# EAGLE design RGBWW-003 (EAGLE 7.7.0)
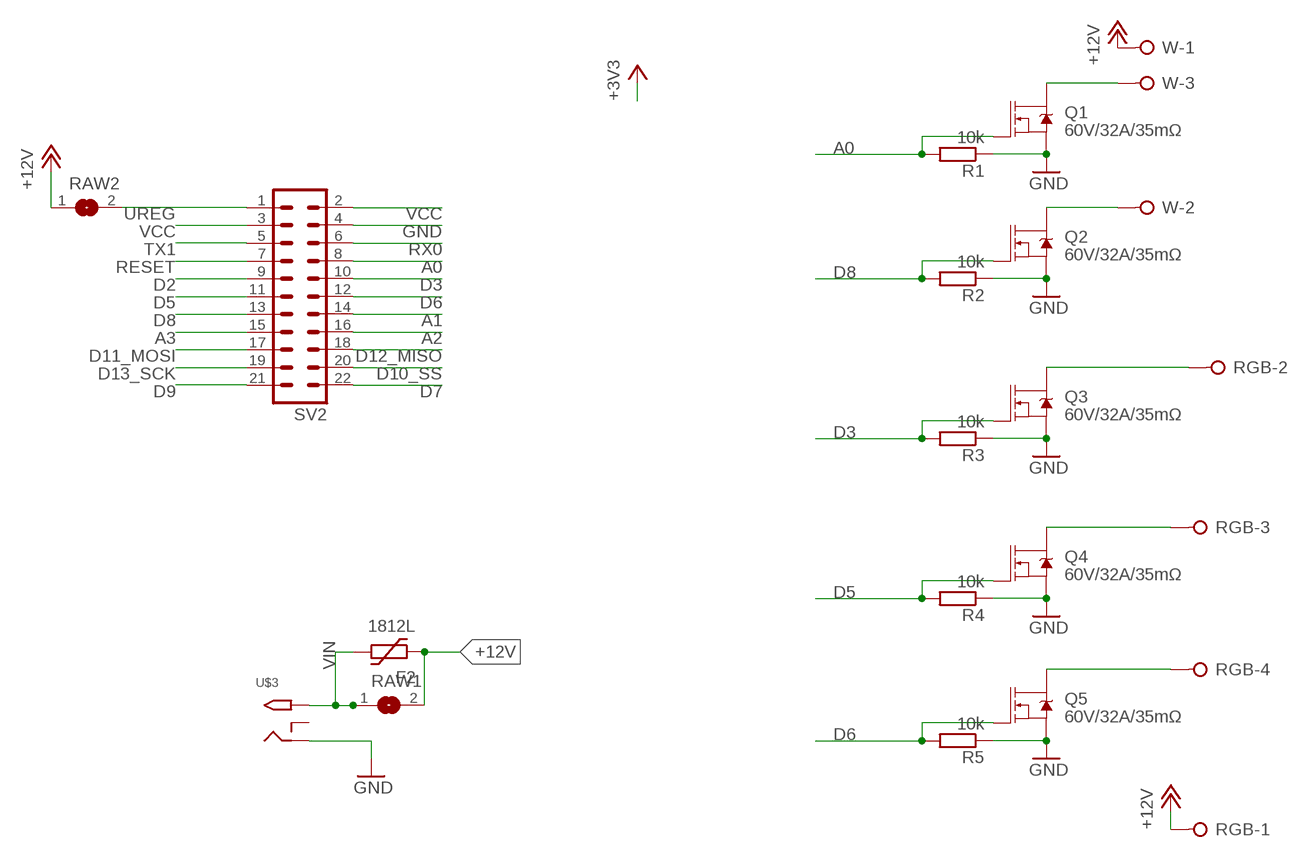
[diagram p0: schematic, sheet 1]

## Parts
F2  1812L  [1812L]
Q1  60V/32A/35mΩ  MOSFET-NCH-FQP30N06L  [TO220V]
Q2  60V/32A/35mΩ  MOSFET-NCH-FQP30N06L  [TO220V]
Q3  60V/32A/35mΩ  MOSFET-NCH-FQP30N06L  [TO220V]
Q4  60V/32A/35mΩ  MOSFET-NCH-FQP30N06L  [TO220V]
Q5  60V/32A/35mΩ  MOSFET-NCH-FQP30N06L  [TO220V]
R1  10k  R-EU_R0805  [R0805]
R2  10k  R-EU_R0805  [R0805]
R3  10k  R-EU_R0805  [R0805]
R4  10k  R-EU_R0805  [R0805]
R5  10k  R-EU_R0805  [R0805]
RAW1  SJ  [SJ]
RAW2  SJ  [SJ]
RGB  W237-04P  [W237-4P]
SV2  MA11-2  [MA11-2]
U$3  2.1MMJACKTHM  [PJ-102A]
W  W237-03P  [W237-133]

## Nets
+12V [12V]: F2.P$1 RAW1.2 RAW2.1 RGB.1 W.1
A0: Q1.1(G) R1.2 SV2.8
A1: SV2.14
A2: SV2.16
A3: SV2.15
D2: SV2.9
D3: Q3.1(G) R3.2 SV2.10
D5: Q4.1(G) R4.2 SV2.11
D6: Q5.1(G) R5.2 SV2.12
D7: SV2.22
D8: Q2.1(G) R2.2 SV2.13
D9: SV2.21
D10_SS: SV2.20
D11_MOSI: SV2.17
D12_MISO: SV2.18
D13_SCK: SV2.19
GND [GNDRGB]: Q1.3(S) Q2.3(S) Q3.3(S) Q4.3(S) Q5.3(S) R1.1 R2.1 R3.1 R4.1 R5.1 SV2.4 U$3.RING
RESET: SV2.7
RGB-WW-OUT [12V]: Q1.2(D) W.3
RGB-WW-OUT1 [12V]: Q2.2(D) W.2
RGB-WW-OUT2 [12V]: Q3.2(D) RGB.2
RGB-WW-OUT3 [GNDRGB]: Q4.2(D) RGB.3
RGB-WW-OUT4: Q5.2(D) RGB.4
RX0: SV2.6
TX1: SV2.5
UREG [12V]: RAW2.2 SV2.1
VCC [12V]: SV2.2 SV2.3
VIN [12V]: F2.P$2 RAW1.1 U$3.TIP
Unconnected: U$3.RING_SW

## Library data of the parts
F2 = ptc-littlefuse:1812L
Q1-Q5 = SparkFun-DiscreteSemi:MOSFET-NCH: N-channel MOSFETs Voltage controlled devices that allow control of high current outputs. SparkFun Products: SparkFun OpenScale <https://www.sparkfun.com/products/13261> SparkFun Digital Sandbox <https://www.sparkfun.com/products/12651> SparkFun Monster Moto Shield <https://www.sparkfun.com/products/10182> SparkFun MOSFET Power Controller <https://www.sparkfun.com/products/11214>; PROD_ID: TRANS-10060
R1-R5 = rcl:R-EU_: RESISTOR, European symbol
RAW1 RAW2 = jumper:SJ: SMD solder JUMPER
RGB = con-wago-508:W237-04P: WAGO SREW CLAMP; OC_FARNELL: unknown; OC_NEWARK: unknown
SV2 = con-Pinheader:MA11-2: PIN HEADER; OC_FARNELL: unknown; OC_NEWARK: unknown
U$3 = adafruit:2.1MMJACK: 2.1mm x 5.5mm THM DC jack with internal switch. Digikey part #PJ-102A, 4UCON part #05537 2.1mm x 5.5mm SMT DC jack with internal switch. Digikey part #PJ-002A-SMT, 4UCON part #03267 By microbuilder.eu & adafruit.com
W = con-wago-508:W237-03P: WAGO SREW CLAMP; OC_FARNELL: unknown; OC_NEWARK: unknown

## Net classes
0 default: width 0.305 mm
1 12V: width 2.286 mm
2 GNDRGB: width 2.286 mm
3 3.3V: width 0.305 mm
4 GND3.3V: width 2.286 mm
5 Signal: width 0.305 mm

## Board
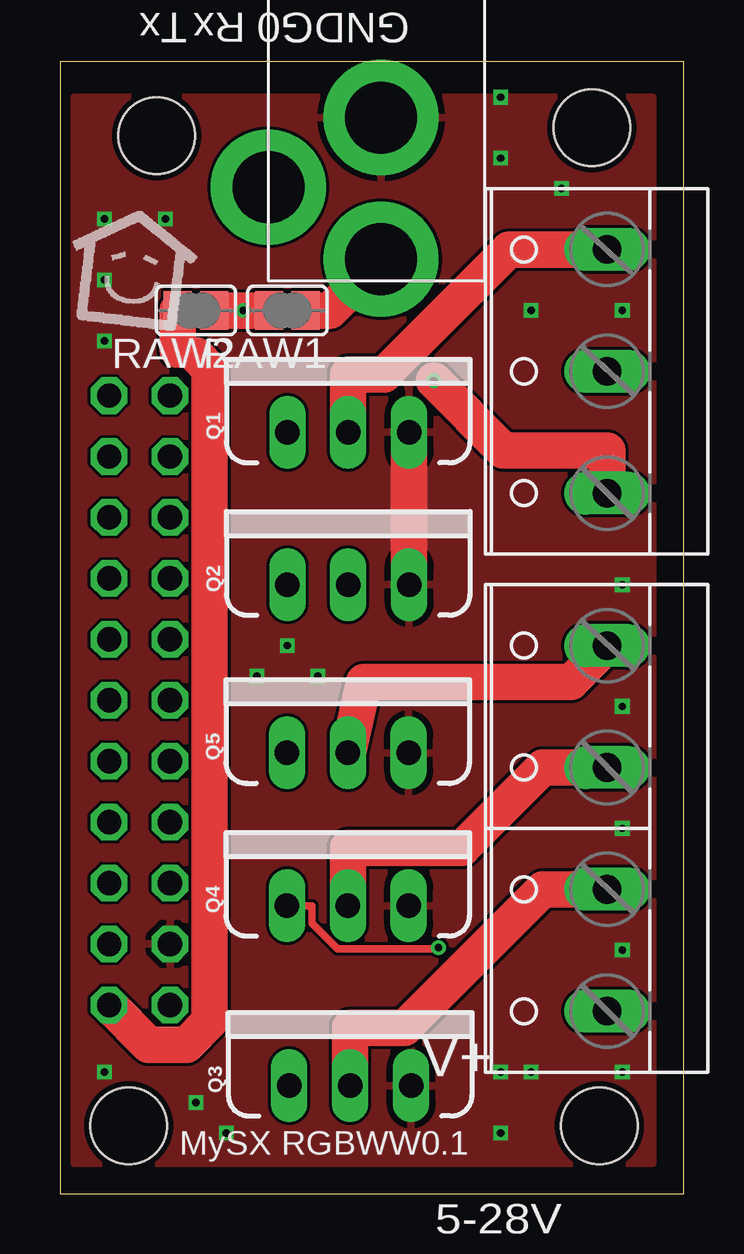
[diagram p1: board, top side]
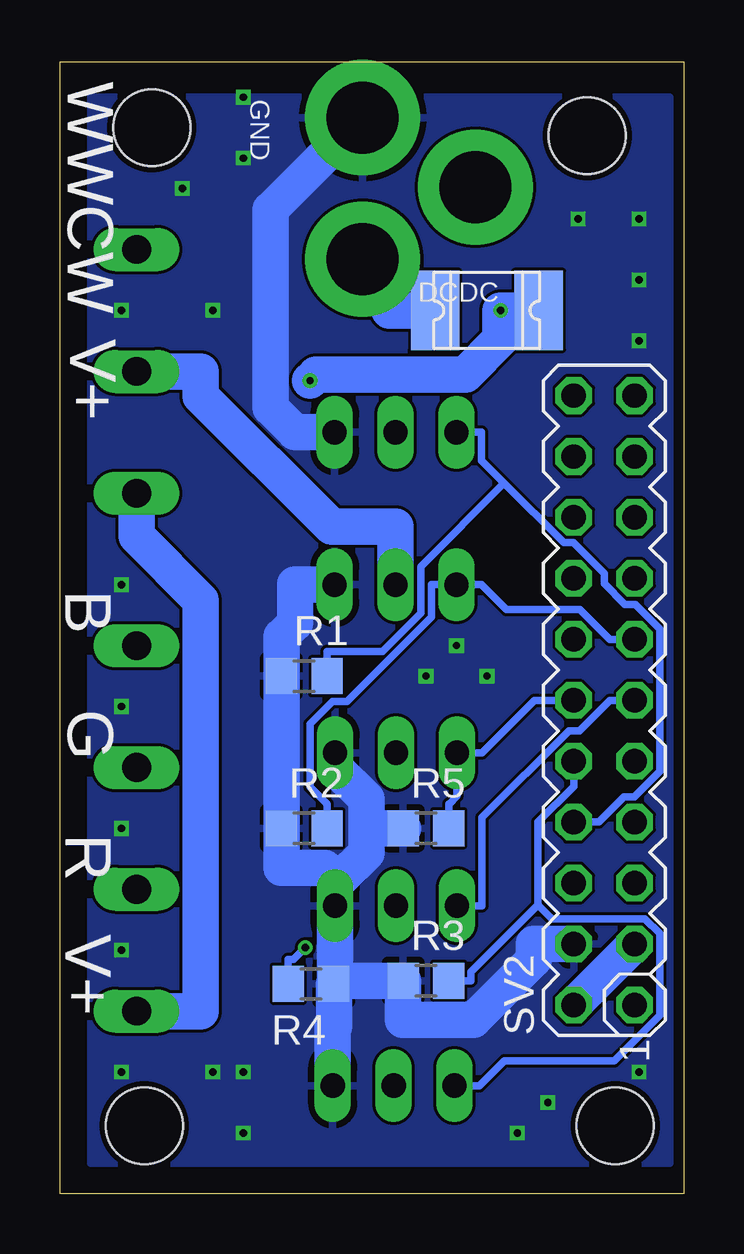
[diagram p2: board, bottom side, seen from below]

Size 26.01 x 47.19 mm. Coordinates in mm from the lower left corner, seen from the top.
Outline: 0,0 26.01,0 26,47.19 0,47.19 0,0
Copper layers (1*16): Top 0.035mm / dielectric 1.5mm / Bottom 0.035mm
Design rules "dirt_cheap_dirty_boards.v1": minimum track width 5mil, minimum drill 12mil, track to track 5mil, track to pad 5mil, pad to pad 5mil, via to via 5mil, smd to smd 0mil, copper to edge 10mil, drill to drill 10mil, minimum pad ring 10mil, minimum via ring 6mil, stop-mask expansion 2mil, vias tented up to drill 25mil, thermal gap 10mil
Holes 3.2 mm at 2.86,2.84 22.49,2.84 22.18,44.45 4.03,44.11

### Footprints (pad centres in the part's own frame; a part is rotated, then mirrored left to right if it is on the bottom)
1812L = smd 2.03 x 3.3: P$1 -2.16,0; P$2 2.16,0
TO220V = drill 1.016 long: 1 -2.54,0; 2 0,0; 3 2.54,0
R0805 = smd 1.3 x 1.5: 1 -0.95,0; 2 0.95,0
SJ = smd 1.168 x 1.6: 1 -0.762,0; 2 0.762,0
W237-4P = drill 1.194 long: 1 -7.62,-0.635; 2 -2.54,-0.635; 3 2.54,-0.635; 4 7.62,-0.635
MA11-2 = drill 1.016 octagon: 1 -12.7,-1.27; 2 -12.7,1.27; 3 -10.16,-1.27; 4 -10.16,1.27; 5 -7.62,-1.27; 6 -7.62,1.27; 7 -5.08,-1.27; 8 -5.08,1.27; 9 -2.54,-1.27; 10 -2.54,1.27; 11 0,-1.27; 12 0,1.27; 13 2.54,-1.27; 14 2.54,1.27; 15 5.08,-1.27; 16 5.08,1.27; 17 7.62,-1.27; 18 7.62,1.27; 19 10.16,-1.27; 20 10.16,1.27; 21 12.7,-1.27; 22 12.7,1.27
PJ-102A = drill 3 pad 4.8: RING 0.1,-3.39; RING_SW -4.6,-6.29; TIP 0.1,-9.29
W237-133 = drill 1.194 long: 1 -5.08,-0.635; 2 0,-0.635; 3 5.08,-0.635

### Placement (x,y rotation side)
F2  8.21,36.83 180 bottom
Q1  12.02,31.75 0 top
Q2  12.02,25.4 0 top
Q3  12.1,4.52 0 top
Q4  12,12.02 0 top
Q5  12,18.39 0 top
R1  15.83,21.59 0 bottom
R2  15.83,15.24 0 bottom
R3  10.75,8.89 0 bottom
R4  15.54,8.76 180 bottom
R5  10.75,15.24 0 bottom
RAW1  9.48,36.83 180 top
RAW2  5.67,36.83 180 top
RGB  22.18,15.24 90 top
SV2  3.32,20.58 90 bottom
U$2  [LOGO]  0.55,35.87 0 top
U$3  13.29,48.26 0 top
W  22.18,34.29 90 top

### Tracks (layer width: path | path; a pad name or v marks a point on that pad's centre or on a via)
+12V  (via drill 0.3 pad 0.61)
  Top 1.168: 6.56,36.83 RAW2.1
  Top 1.524: W.1 22.81,30.99 18.49,30.99 v15.59,33.9 | RAW1.2 v7.64,36.83 6.56,36.83
  Bottom 1.524: v15.59,33.9 15.33,34.16 9.11,34.16 7.64,35.64 v7.64,36.83 F2.P$1 | RGB.1 20.13,7.62 20.13,24.75 22.81,27.43 W.1
A0
  Bottom 0.305: 7.49,29.63 8.44,30.58 8.44,31.75 Q1.1 | 7.49,29.63 5.01,27.15 4.6,27.15 3.32,25.86 3.32,25.45 2.45,24.57 2.03,24.57 1.01,23.55 1.01,17.61 2.07,16.54 2.51,16.54 3.55,15.5 SV2.8 | 7.49,29.63 10.95,26.16 10.95,24.23 12.56,22.62 14.88,22.62 R1.2
D3
  Bottom 0.305: 6.09,12.05 5.5,11.46 1.62,11.46 1.01,10.85 1.01,7.45 2.9,5.56 7.48,5.56 8.52,4.52 Q3.1 | 6.09,12.05 6.09,15.5 4.59,17 SV2.10 | 6.09,12.05 8.87,9.27 8.87,8.89 R3.2
D5  (via drill 0.3 pad 0.61)
  Top 0.305: Q4.1 10.5,12.02 10.5,11.28 11.57,10.21 15.73,10.21 v15.78,10.27
  Bottom 0.305: R4.2 16.49,9.79 16.26,9.79 v15.78,10.27 | Q4.1 8.42,12.02 8.42,15.69 4.8,19.31 4.36,19.31 3.09,20.58 SV2.11
D6
  Bottom 0.305: R5.2 9.8,16.27 9.78,16.27 9.46,16.59 Q5.1 8.42,18.39 6.23,20.58 SV2.12
D8
  Bottom 0.305: R2.2 14.88,16.27 15.58,16.97 15.58,19.58 14.64,20.53 14.04,20.53 10.52,24.05 10.52,25.4 Q2.1 8.44,25.4 7.4,24.36 4.33,24.36 3.09,23.12 SV2.13
GND  (via drill 0.3 pad 0.61)
  Top 1.524: Q2.3 Q1.3
  Bottom 1.524: 14.54,8.89 14.54,8.81 R4.1 14.59,6.98 14.64,6.93 Q3.3 | 14.54,8.89 Q4.3 14.54,13.16 | 14.54,8.89 13.24,8.89 R3.1 11.7,7.25 8.78,7.25 6.24,9.79 6.24,10.42 SV2.4 | 13.24,15.24 13.24,16.47 14.54,17.77 Q5.3 | 14.54,13.16 14.3,13.16 13.24,14.22 13.24,15.24 | 14.54,13.16 14.98,13.6 16.78,13.6 R2.1 16.78,19.95 R1.1 16.78,23.23 16.21,23.8 16.21,25.4 Q2.3 | R5.1 13.24,15.24 | U$3.RING 17.24,41.02 17.24,32.77 16.21,31.75 Q1.3
  other vias: 1.86,40.64 1.86,38.1 1.86,35.56 4.4,40.64 18.37,45.72 18.37,43.18 20.91,41.91 19.64,36.83 9.48,22.86 8.21,21.59 10.75,21.59 5.67,3.81 1.86,5.08 6.94,2.54 18.37,2.54 18.37,5.08 19.64,5.08 23.45,5.08 23.45,10.16 23.45,15.24 23.45,20.32 23.45,25.4 23.45,36.83
  pour Bottom: 0.59,1.27 0.59,45.72 24.72,45.72 24.72,1.27
  pour Top: 0.59,45.72 24.72,45.72 24.72,1.27 0.59,1.27
RGB-WW-OUT
  Top 1.524: W.3 18.72,39.37 13.51,34.16 12.02,34.16 Q1.2
RGB-WW-OUT1
  Bottom 1.524: Q2.2 12.02,27.81 14.68,27.81 20.13,33.27 20.13,34.29 W.2
RGB-WW-OUT2
  Top 1.524: RGB.2 20.13,12.7 14.37,6.93 12.1,6.93 Q3.2
RGB-WW-OUT3
  Top 1.524: RGB.3 20.13,17.78 16.79,14.43 12,14.43 Q4.2
RGB-WW-OUT4
  Top 1.524: Q5.2 12.68,21.34 21.3,21.34 RGB.4
UREG
  Top 1.168: 5.69,34.94 5.43,35.2 4.91,35.2
  Top 1.524: 4.91,35.2 RAW2.2 | SV2.1 3.7,6.22 5.27,6.22 6.24,7.2 6.24,34.39 5.69,34.94
VCC
  Bottom 1.524: SV2.3 SV2.2
VIN
  Top 1.168: F2.P$2 RAW1.1
  Top 1.524: F2.P$2 11.25,36.83 U$3.TIP
  Bottom 1.524: F2.P$2 12.27,36.83 12.27,37.85 U$3.TIP

### Text on the board
tNames: Tx | Rx | G0 | GND | V+ | MySX RGBWW0.1 | 5-28V | max / 16A | GND
bNames: GND | WW | CW | DCDC | V+ | B | G | R | V+